# EAGLE design batteryholder2S6P_vertical_top_2 (EAGLE 9.5.1)
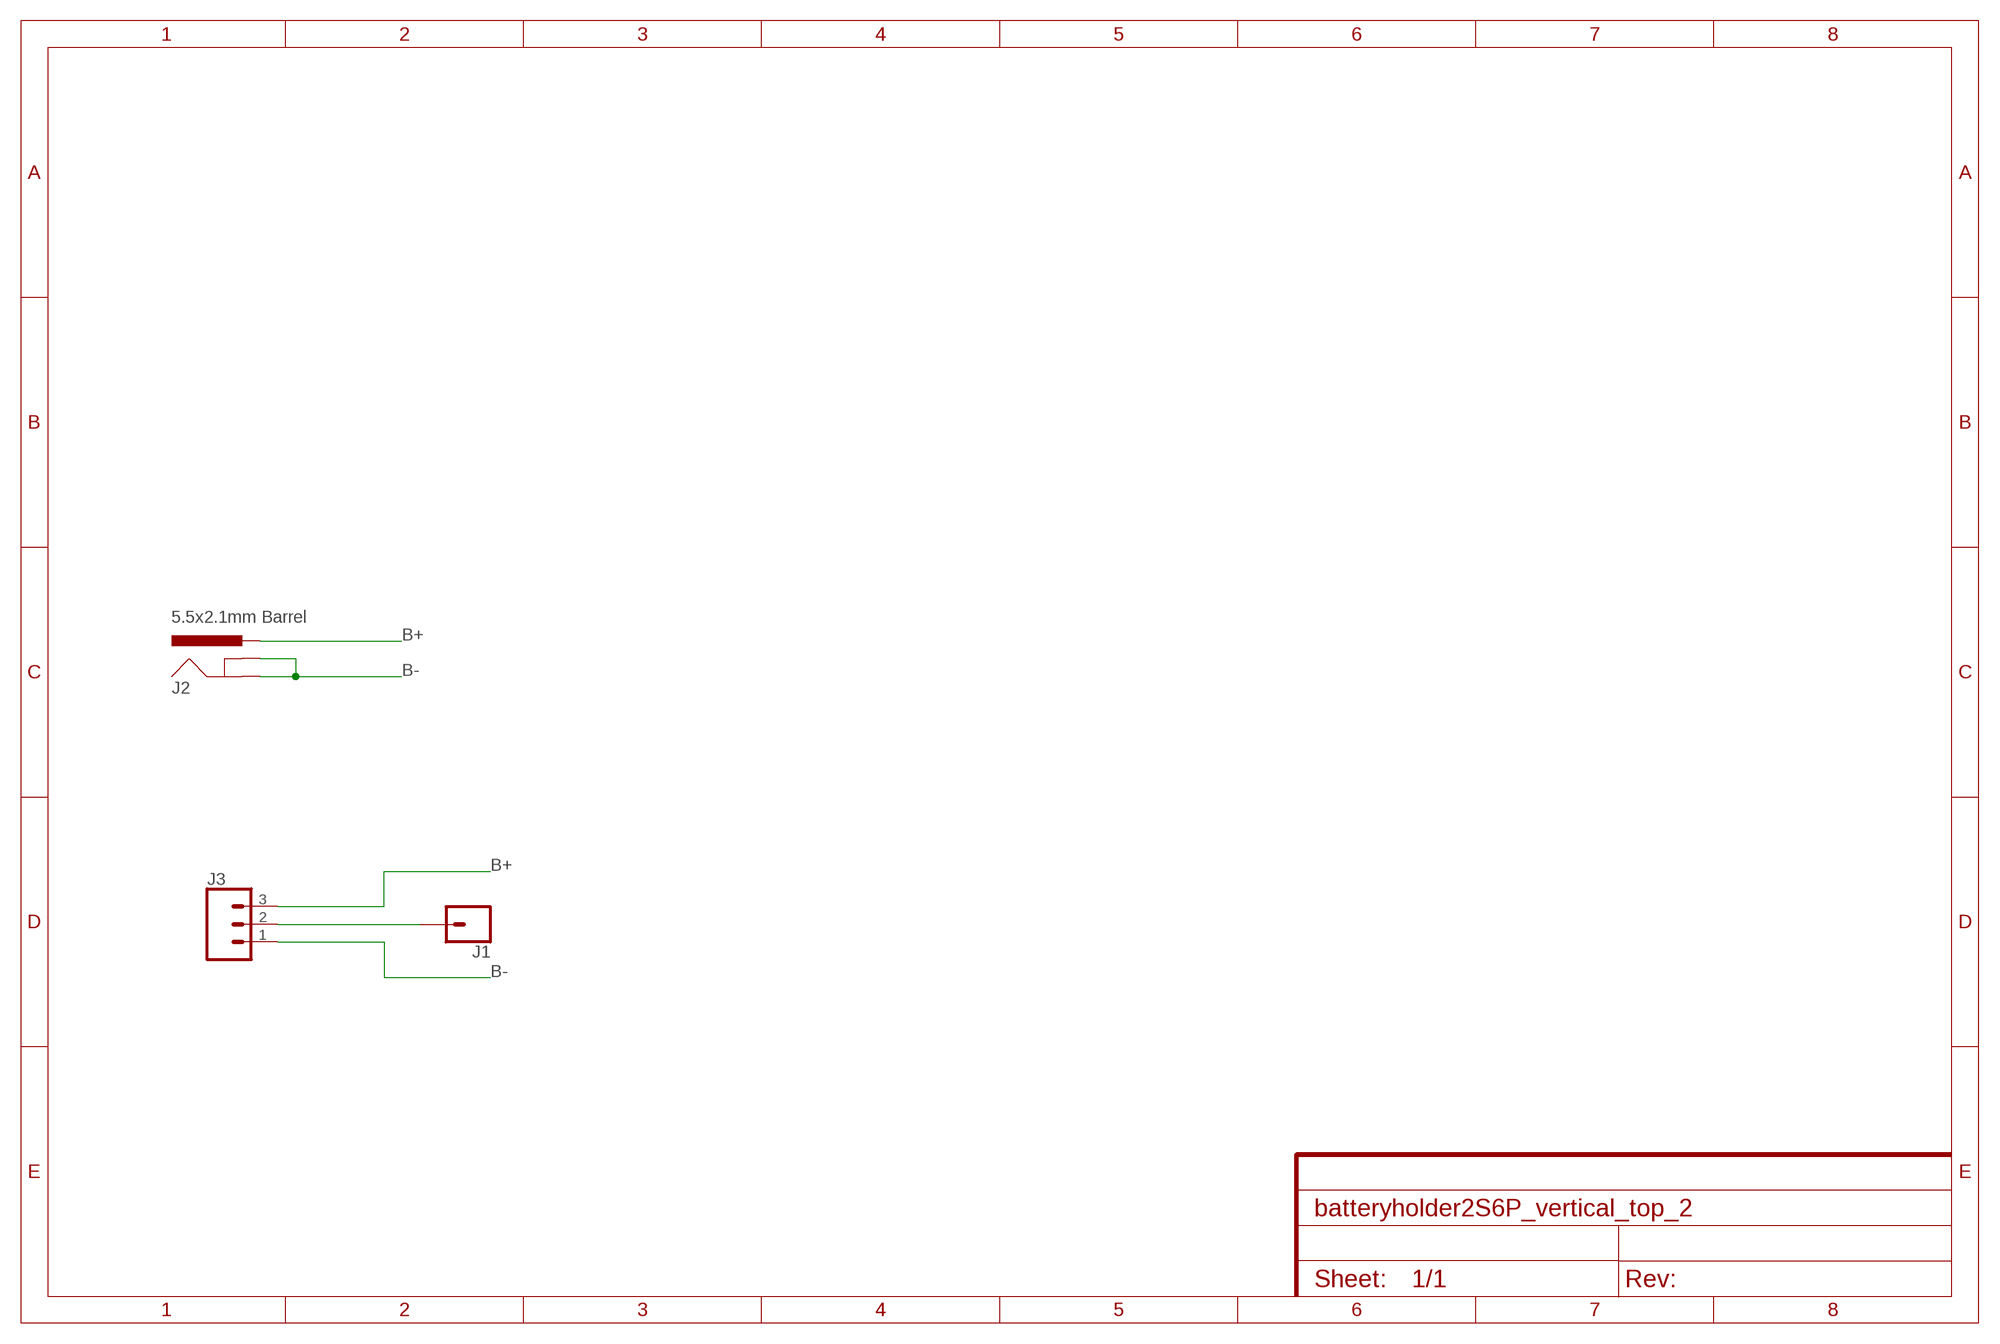
[diagram p0: schematic, sheet 1]

## Parts
J1  CONN_01PTH_2MM  [1X01_2MM]
J2  5.5x2.1mm Barrel  POWER_JACKSMD  [POWER_JACK_SMD]
J3  CONN_03-SCREW-5MM  [SCREWTERMINAL-5MM-3]

## Nets
B+: J2.VIN0(PWR) J3.3
B-: J2.GND(GNDBREAK) J2.P$4(GND) J3.1
N$3: J1.1 J3.2

## Library data of the parts
J1 = SparkFun-Connectors:CONN_01: Single connection point. Often used as Generic Header-pin footprint for 0.1 inch spaced/style header connections On any of the 0.1 inch spaced packages, you can populate with these: Break Away Headers - Straight <https://www.sparkfun.com/products/116> (PRT-00116) Break Away Male Headers - Right Angle <https://www.sparkfun.com/products/553> (PRT-00553) Female Headers <https://www.sparkfun.com/products/115> (PRT-00115) Break Away Headers - Machine Pin <https://www.sparkfun.com/products/117> (PRT-00117) Break Away Female Headers - Swiss Machine Pin <https://www.sparkfun.com/products/743> (PRT-00743) This device is also useful as a general connection point to wire up your design to another part of your project. Our various solder wires solder well into these plated through hole pads. Hook-Up Wire - Assortment (Stranded, 22 AWG) <https://www.sparkfun.com/products/11375> (PRT-11375) Hook-Up Wire - Assortment (Solid Core, 22 AWG) <https://www.sparkfun.com/products/11367> (PRT-11367) View the entire wire category on our website here <https://www.sparkfun.com/categories/141> Special notes: SMTSO-256-ET is a "flush mount" nut for a 4-40 screw. We mostly use this on specialty testbeds; it is a nice way to connect hardware to your PCB at an adjustable hieght. Also note, the SNAP packages are for using a snappable style connector. We sell a baggie of snaps and they are also used on two LilyPad designs: Snap Assortment - 30 pack (male and female) <https://www.sparkfun.com/products/11347> (DEV-11347) LilyPad Arduino SimpleSnap <https://www.sparkfun.com/products/10941> (DEV-10941) LilyPad SimpleSnap Protoboard <https://www.sparkfun.com/products/10940> (DEV-10940)
J2 = SparkFun-Connectors:POWER_JACK: Power Jack Connector This is the standard 5.5mm barrel jack for power. The PTH is the most common, proven, reliable, footprint. The Slot footprint only works if the mill layer is transmitted to the PCB fab house so be warned. Here are the connectors we sell at SparkFun: DC Barrel Power Jack/Connector <https://www.sparkfun.com/products/119> (PRT-00119) DC Barrel Power Jack/Connector (SMD) <https://www.sparkfun.com/products/12748> (PRT-12748) DC Barrel Jack Adapter - Breadboard Compatible <https://www.sparkfun.com/products/10811> (PRT-10811) It is used on this SparkFun product (and many, many others): SparkFun RedBoard - Programmed with Arduino <https://www.sparkfun.com/products/12757> (DEV-12757) Also, if you need a mating power supply or connector, please check these out: Wall Adapter Power Supply - 9VDC 650mA <https://www.sparkfun.com/products/298> (TOL-00298) DC Barrel Jack Adapter - Male <https://www.sparkfun.com/products/10287> (PRT-10287); PROD_ID: CONN-08106; SF_ID: PRT-12748
J3 = SparkFun-Connectors:CONN_03: Multi connection point. Often used as Generic Header-pin footprint for 0.1 inch spaced/style header connections On any of the 0.1 inch spaced packages, you can populate with these: Break Away Headers - Straight <https://www.sparkfun.com/products/116> (PRT-00116) Break Away Male Headers - Right Angle <https://www.sparkfun.com/products/553> (PRT-00553) Female Headers <https://www.sparkfun.com/products/115> (PRT-00115) Break Away Headers - Machine Pin <https://www.sparkfun.com/products/117> (PRT-00117) Break Away Female Headers - Swiss Machine Pin <https://www.sparkfun.com/products/743> (PRT-00743) Stackable Header - 3 Pin (Female, 0.1") <https://www.sparkfun.com/products/13875> (PRT-13875) For SCREWTERMINALS and SPRING TERMINALS visit here: Screw Terimnals on SparkFun.com <https://www.sparkfun.com/search/results?term=Screw+Terminals> (5mm/3.5mm/2.54mm spacing) This device is also useful as a general connection point to wire up your design to another part of your project. Our various solder wires solder well into these plated through hole pads. Hook-Up Wire - Assortment (Stranded, 22 AWG) <https://www.sparkfun.com/products/11375> (PRT-11375) Hook-Up Wire - Assortment (Solid Core, 22 AWG) <https://www.sparkfun.com/products/11367> (PRT-11367) View the entire wire category on our website here <https://www.sparkfun.com/categories/141> Special notes: Molex polarized connector foot print use with SKU : PRT-08232 with associated crimp pins and housings.; PROD_ID: CONN-10134; SF_SKU: PRT-08433

## Board
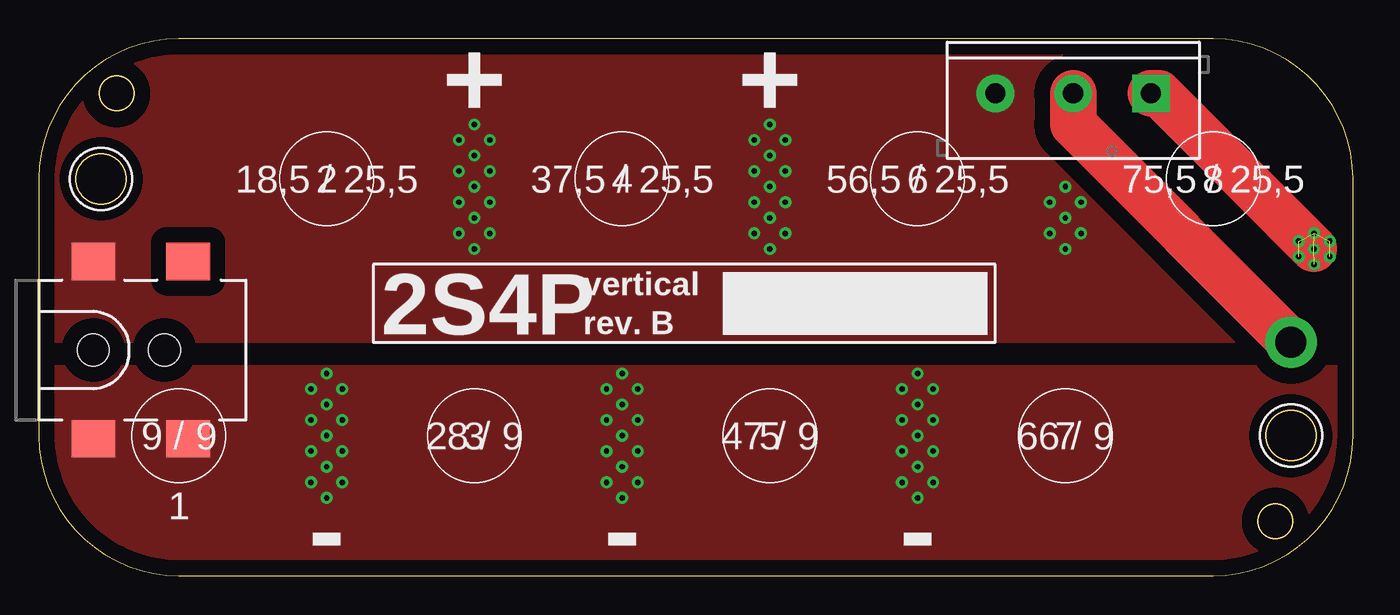
[diagram p1: board, top side]
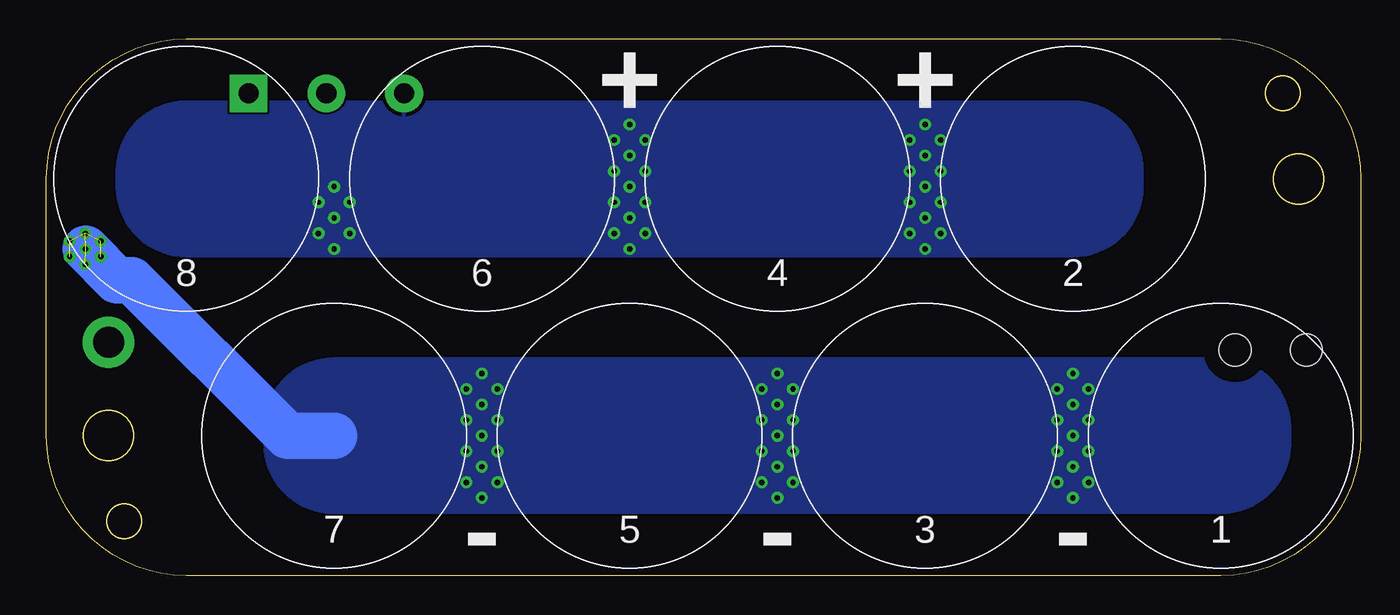
[diagram p2: board, bottom side, seen from below]

Size 84.5 x 34.5 mm. Coordinates in mm from the lower left corner, seen from the top.
Outline: 75.5,34.5 9,34.5 arc90 0,25.5 0,9 arc90 9,0 75.5,0 arc90 84.5,9 84.5,25.5 arc90 75.5,34.5
Outline: circle at 4,25.5 radius 1.6
Outline: circle at 80.5,9 radius 1.6
Outline: circle at 5,31 radius 1.1
Outline: circle at 79.5,3.5 radius 1.1
Copper layers (1*16): Top 0.035mm / dielectric 1.5mm / Bottom 0.035mm
Design rules "default": minimum track width 6mil, minimum drill 0.35mm, track to track 6mil, track to pad 6mil, pad to pad 6mil, via to via 6mil, smd to smd 6mil, copper to edge 40mil, drill to drill 6mil, minimum pad ring 10mil, minimum via ring 8mil, stop-mask expansion 4mil, vias tented up to drill 0mil, thermal gap 10mil

### Footprints (pad centres in the part's own frame; a part is rotated, then mirrored left to right if it is on the bottom)
1X01_2MM = drill 2 pad 3.302: 1 0,0
POWER_JACK_SMD = smd 2.8 x 2.4: GND 0,-5.7; P$4 6.1,-5.7; VIN0 0,5.7; VIN1 6.1,5.7 | hole 2.032: 0,0; 4.572,0
SCREWTERMINAL-5MM-3 = drill 1.3 pad 2.413 square: 1 0,0 | drill 1.3 pad 2.413: 2 5,0; 3 10,0

### Placement (x,y rotation side)
J1  80.5,15 0 top
J2  3.5,14.5 0 top
J3  71.5,31 180 top

### Tracks (layer width: path | path; a pad name or v marks a point on that pad's centre or on a via)
B+  (via drill 0.35)
  other vias: 28,21 28,23 28,25 28,27 28,29 29,22 27,22 47,23 47,21 48,22 46,22 47,25 47,27 47,29 29,24 27,24 27,26 29,26 27,28 29,28 48,24 46,24 46,26 46,28 48,26 48,28 66,21 67,22 65,22 66,23 67,24 65,24 66,25
  pour Top (isolate 1, no thermals): 0,15 84,15 84,34.5 0,34.5
  pour Bottom: 14,25 14,26 arc-90 18.5,30.5 75.5,30.5 arc-90 80,26 80,25 arc-90 75.5,20.5 18.5,20.5 arc-90
B-  (via drill 0.35)  (6 unrouted)
  Top 3: v81.98,21 81.98,21.02 72,31 J3.1
  Bottom 3: v81.98,21 79.98,19 79,19 69,9 66,9
  other vias: 81,21.5 83,21.5 81,20.5 83,20.5 82,20 82,22 18.5,5 18.5,7 18.5,9 18.5,11 18.5,13 37.5,5 37.5,7 37.5,9 37.5,11 37.5,13 56.5,5 56.5,7 56.5,9 56.5,11 56.5,13 17.5,6 19.5,6 17.5,8 19.5,8 19.5,10 17.5,10 19.5,12 17.5,12 38.5,6 36.5,6 36.5,8 36.5,12 38.5,12 38.5,10 36.5,10 38.5,8 57.5,6 55.5,6 55.5,8 57.5,8 57.5,10 55.5,10 57.5,12 55.5,12
  pour Top (isolate 1, no thermals): 0,13.5 0,0 85,0 85,13.5
  pour Bottom: 66,14 9,14 arc90 4.5,9.5 4.5,8.5 arc90 9,4 66,4 arc90 70.5,8.5 70.5,9.5 arc90
N$3
  Top 3: J3.2 66.5,29 J1.1

### Text on the board
tPlace: + | + | 2 | 4 | 6 | 8 | 2S4P | vertical | rev. B | 3 | 5 | 7 | 1 | - | - | -
bPlace: + | + | 2 | 4 | 6 | 8 | 1 | - | 3 | - | 5 | - | 7
tNames: 18,5 / 25,5 | 37,5 / 25,5 | 56,5 / 25,5 | 75,5 / 25,5 | 9 / 9 | 28 / 9 | 47 / 9 | 66 / 9